# EasyEDA Pro project ui ring v1.eprj

# Schematic Schematic1
Board Name: Board1; Create Date: 2025-07-10; Page Name: P1; Project Name: ui ring v1; Schematic Name: Schematic1; Update Date: 2025-07-10; Company: EasyEDA.com; Page Size: A4; Version: V1.0
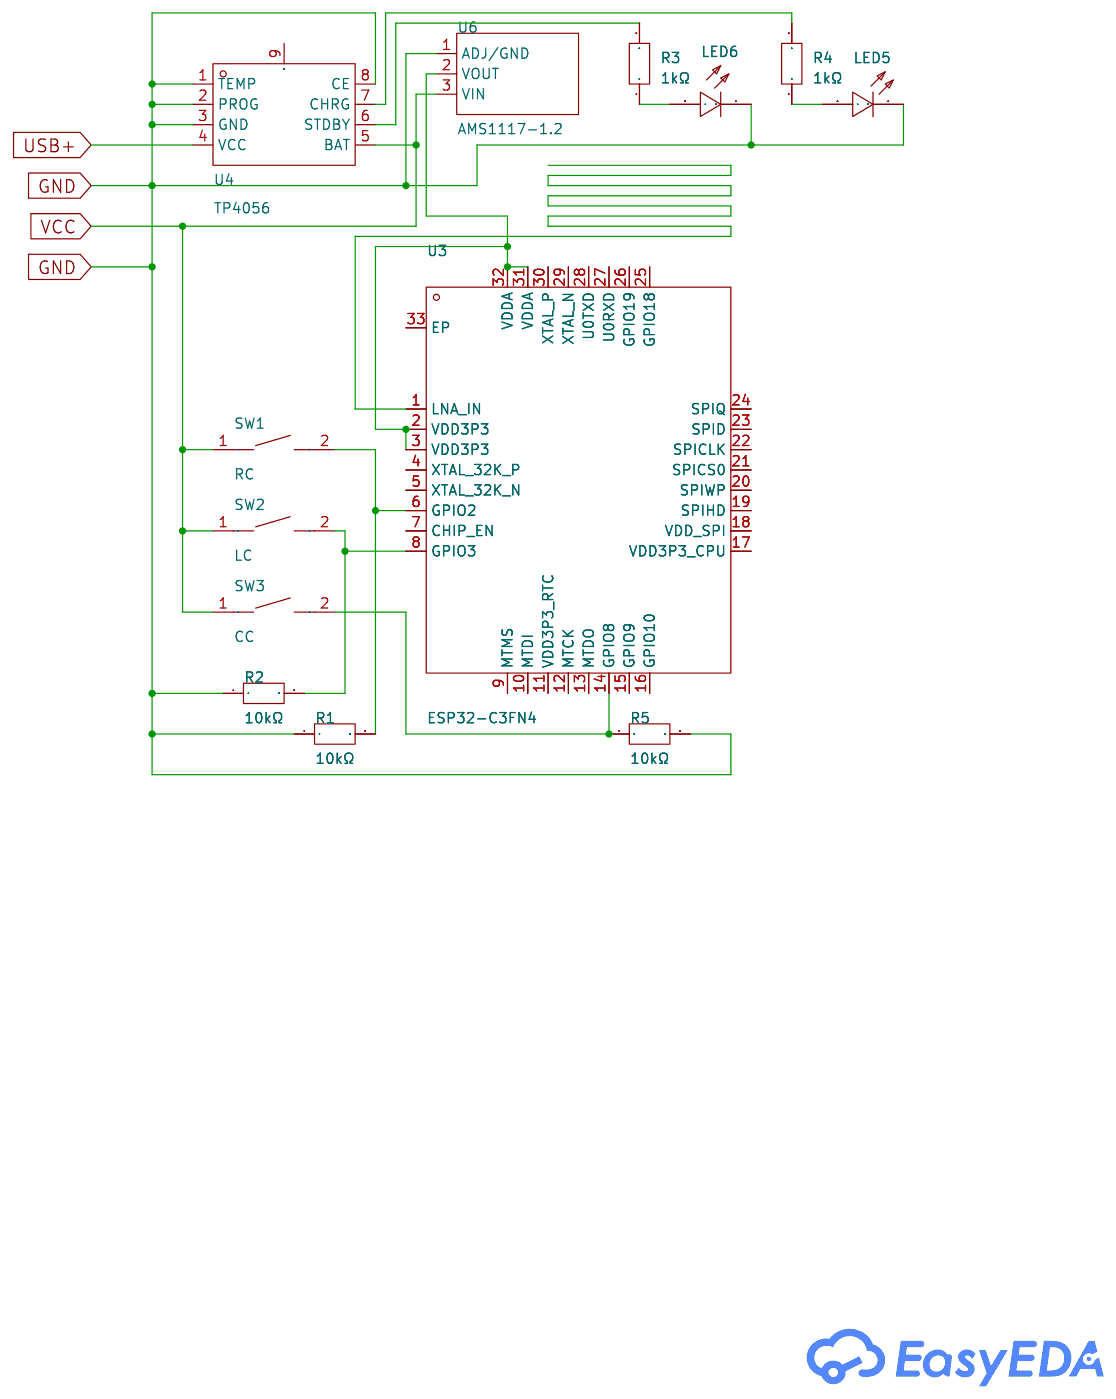
[diagram p0: schematic sheet]

## Parts
LED5  19-217/BHC-ZL1M2RY/3T  [LED0603-FD_BLUE]
LED6  19-217/R6C-AL1M2VY/3T  [LED0603-RD]
R1  10kΩ  [R0402]
R2  10kΩ  [R0402]
R3  1kΩ  [R0402]
R4  1kΩ  [R0402]
R5  10kΩ  [R0402]
SW1  RC  [SW-SMD_L3.9-W3.0-P4.45]
SW2  LC  [SW-SMD_L3.9-W3.0-P4.45]
SW3  CC  [SW-SMD_L3.9-W3.0-P4.45]
U3  ESP32-C3FN4  [QFN-32_L5.0-W5.0-P0.50-BL-EP3.7]
U4  TP4056  [ESOP-8_L4.9-W3.9-P1.27-LS6.0-BL-EP-4]
U6  AMS1117-1.2  [SOT-89-3_L4.5-W2.5-P1.50-LS4.2-BR]

## Library data of the parts
LED5 = 19-217/BHC-ZL1M2RY/3T: LCSC Part Name: 蓝灯 停产; Supplier Part: C72041; Manufacturer: EVERLIGHT(亿光); Supplier Footprint: 0603; JLCPCB Part Class: Extended Part; Datasheet: https://atta.szlcsc.com/upload/public/pdf/source/20170116/1484561237273.pdf; Supplier: LCSC; Emitted Color: Blue; Power Dissipation: 110mW; Forward Current: 5mA; Dominant Wavelength: 465nm~475nm; Peak Wavelength: 468nm; Lens Color: Colorless Transparent Lens; Viewing Angle: 120°; Operating Temperature: -40℃~+85℃
LED6 = 19-217/R6C-AL1M2VY/3T: LCSC Part Name: 红灯 停产; Supplier Part: C72044; Manufacturer: EVERLIGHT(亿光); Supplier Footprint: 0603; JLCPCB Part Class: Extended Part; Supplier: LCSC; Illumination Color: Red; Voltage - Forward(Vf): 1.95V; Power(Watts): 60mW; Forward Current: 5mA; Wavelength - Dominant: 617.5nm; Peak Wavelength: 632nm; Lens Color: Water Clear; Viewing Angle: 120°; Operating Temperature: -40℃~+85℃
R1-R5 = AC0402FR-1310KL: LCSC Part Name: 厚膜电阻 10kΩ ±1% 63mW; Supplier Part: C5455563; Manufacturer: YAGEO(国巨); Supplier Footprint: 0402; JLCPCB Part Class: Extended Part; Datasheet: https://atta.szlcsc.com/upload/public/pdf/source/20241120/4D446B3946E6DC27047BD586A1D384B4.pdf; Supplier: LCSC; Type: Thick Film Resistor; Tolerance: ±1%; Power(Watts): 63mW; Temperature Coefficient: ±100ppm/℃; Operating Temperature: -55℃~+155℃
SW1-SW3 = TS-1088-AR02016: LCSC Part Name: 4*3*2mm 立贴 轻触开关; Supplier Part: C720477; Manufacturer: XUNPU(讯普); Supplier Footprint: SMD; JLCPCB Part Class: Basic Part; Datasheet: https://atta.szlcsc.com/upload/public/pdf/source/20200810/C720475_60D09DD6C54279ADDB2DC25100F1CC11.pdf; Supplier: LCSC; Circuit: SPST; Actuator Style: Round Button; Operating Force: 160gf; Mounting Style: Brick nogging; Switch Length: 4mm; Switch Width: 3mm; Switch Height: 2mm; Strike Gundam: 不带; Contact Current: 50mA; Voltage Rating (DC): 12V; Insulation Resistance: 100MΩ; Actuator/Cap Color: Black; Pin Style: SMDSplicing; Mechanical Life: 10万次; Operating Temperature: -30℃~+80℃
U3 = ESP32-C3FN4: LCSC Part Name: 搭载 RISC-V 32 位单核处理器的极低功耗 SoC; Supplier Part: C2848860; Manufacturer: ESPRESSIF(乐鑫); Supplier Footprint: QFN-32-EP(5x5); JLCPCB Part Class: Extended Part; Datasheet: https://atta.szlcsc.com/upload/public/pdf/source/20240822/B2742F38BA1EE0E2910459276C4BCB53.pdf; Supplier: LCSC
U4 = TP4056_C20199357: Supplier Part: C20199357; Manufacturer: YONGYUTAI(永裕泰); Supplier Footprint: ESOP-8; JLCPCB Part Class: Extended Part; Datasheet: https://atta.szlcsc.com/upload/public/pdf/source/20231229/07E8AA7136184765E9792E4EED78D64E.pdf; Supplier: LCSC; Supply Voltage: 4.35V~6.5V; Maximum Charge Current: 1A; Type of Battery: Lithium-ion/Polymer; Number of Cells: 1; Operating Temperature: -40℃~+85℃
U6 = AMS1117-1.2_C963407: Supplier Part: C963407; Manufacturer: JSMSEMI(杰盛微); Supplier Footprint: SOT-89-3; JLCPCB Part Class: Extended Part; Datasheet: https://atta.szlcsc.com/upload/public/pdf/source/20240105/143A9572A7E269EE9769F526304F9FCC.pdf; Supplier: LCSC; Output Type: Fixed; Voltage - Supply: 12V; Output Voltage: 1.2V; Output Current: 1A; Power Supply Rejection Ratio (PSRR): 75dB@(120Hz); Features: Overcurrent Protection; Operating Temperature: -40℃~+125℃@(Tj); Output Configuration: Positive electrode; Number of Outputs: 1

## Nets
GND: LED5.1(C) LED6.1(C) R1.1 R2.1 R5.2 U4.1(TEMP) U4.2(PROG) U4.3(GND) U4.8(CE) U6.1(ADJ/GND)
VCC: SW1.1 SW2.1 SW3.1 U4.5(BAT) U6.3(VIN)
USB+: U4.4(VCC)
$1N2456: U3.2(VDD3P3) U3.3(VDD3P3) U3.31(VDDA) U3.32(VDDA) U6.2(VOUT)
$1N2832: LED5.2(A) R4.1
$1N2834: LED6.2(A) R3.1
$1N2838: R3.2 U4.6(STDBY)
$1N2844: R4.2 U4.7(CHRG)
$1N3009: R5.1 SW3.2 U3.14(GPIO8)
Net-(R1-2): R1.2 SW1.2 U3.6(GPIO2)
Net-(R2-2): R2.2 SW2.2 U3.8(GPIO3)

Not connected (* = marked no-connect by the designer): U3 1(LNA_IN) 4(XTAL_32K_P) 5(XTAL_32K_N) 7(CHIP_EN) 9(MTMS) 10(MTDI) 11(VDD3P3_RTC) 12(MTCK) 13(MTDO) 15(GPIO9) 16(GPIO10) 17(VDD3P3_CPU) 18(VDD_SPI) 19(SPIHD) 20(SPIWP) 21(SPICS0) 22(SPICLK) 23(SPID) 24(SPIQ) 25(GPIO18) 26(GPIO19) 27(U0RXD) 28(U0TXD) 29(XTAL_N) 30(XTAL_P) 33(EP); U4 9(PAD)

# Board PCB1
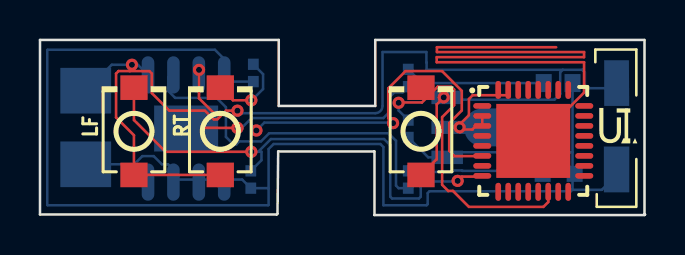
[diagram p1: board, top side]
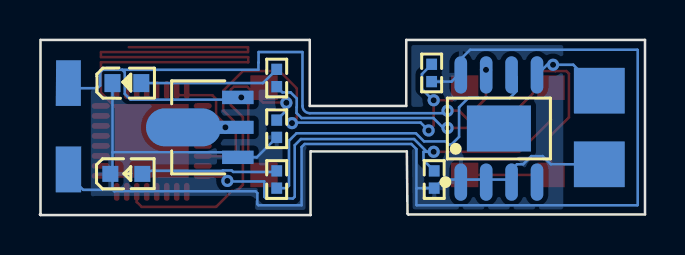
[diagram p2: board, bottom side, seen from below]

Outline 30.25 x 8.76 mm; copper layers: Top Layer, Bottom Layer. Coordinates in mm from the lower left corner of the outline.
Outline path: 0,8.76 11.94,8.76 11.94,5.46 16.76,5.46 16.76,8.76 30.23,8.76 30.23,0.05 30.25,0.03 30.22,0 16.72,0 16.72,3.18 11.91,3.18 11.88,0.07 11.84,0.03 0,0.03 0,8.76
Stack: Top Layer 0.035mm / Dielectric1 1.51mm FR4 er 4.5 / Bottom Layer 0.035mm

## Design rules (mm)
template: JLCPCB Capability(Two Layers Board)
spacing copperThickness1oz (default): track to track 0.102, other pairs 0.152 to 0.3
spacing copperThickness2oz: track to track 0.203, other pairs 0.152 to 0.3
track width copperThickness1oz (default): min 0.127, default 0.254, max 2.54
track width copperThickness2oz: min 0.203, default 0.254, max 2.54
differential pair differentialPair (default): width min 0.127, default 0.254, max 2.54; gap min 0.152, default 0.152
via viaSize (default): diameter min 0.5, default 0.61, max 10; hole min 0.3, default 0.305, max 6.3

## Placement (name value [footprint] x y rotation side)
LED5  19-217/BHC-ZL1M2RY/3T  [LED0603-FD_BLUE]  25.91 6.6 180 bottom
LED6  19-217/R6C-AL1M2VY/3T  [LED0603-RD]  25.93 2.06 180 bottom
LF  LC  [SW-SMD_L3.9-W3.0-P4.45]  4.7 4.19 90 top
NOREF  -  [Pad_e467]  2.29 6.22 0 top
NOREF#2  -  [Pad_e465]  28.83 6.6 0 top
NOREF#3  -  [Pad_e466]  28.83 2.28 0 top
NOREF#4  -  [Pad_e468]  2.29 2.54 0 top
R1  10kΩ  [R0402]  10.67 7.11 90 bottom
R2  10kΩ  [R0402]  10.54 1.78 90 bottom
R3  1kΩ  [R0402]  18.41 1.78 270 bottom
R4  1kΩ  [R0402]  18.41 6.86 270 bottom
R5  10kΩ  [R0402]  18.41 4.32 270 bottom
RT  RC  [SW-SMD_L3.9-W3.0-P4.45]  9.02 4.19 90 top
SW3  CC  [SW-SMD_L3.9-W3.0-P4.45]  19.05 4.19 90 top
U3  ESP32-C3FN4  [QFN-32_L5.0-W5.0-P0.50-BL-EP3.7]  24.66 3.71 270 top
U4  TP4056  [ESOP-8_L4.9-W3.9-P1.27-LS6.0-BL-EP-4]  7.31 4.33 180 bottom
U6  AMS1117-1.2  [SOT-89-3_L4.5-W2.5-P1.50-LS4.2-BR]  21.72 4.39 180 bottom

## Footprints (pads in the part's own frame, mm; a bottom-side part is the same pattern mirrored in y, then rotated)
ESOP-8_L4.9-W3.9-P1.27-LS6.0-BL-EP-4
  oval 0.63x1.865 smd: 1(-1.905,-2.683) 2(-0.635,-2.683) 3(0.635,-2.683) 4(1.905,-2.683) 5(1.905,2.683) 6(0.635,2.683) 7(-0.635,2.683) 8(-1.905,2.683)
  rect 3.2x2.3 smd: 9(0,0)
LED0603-FD_BLUE
  rect 0.8x0.9 smd: 1(-0.72,0) 2(0.72,0)
LED0603-RD
  rect 0.8x0.8 smd: 1(-0.799,0) 2(0.799,0)
Pad_e465
  custom 1.27x2.286 smd far side: 4(0,0)
Pad_e466
  custom 1.288x2.292 smd far side: 34(0,0)
Pad_e467
  custom 2.546x2.286 smd far side: 35(0,0)
Pad_e468
  custom 2.54x2.286 smd far side: 36(0,0)
QFN-32_L5.0-W5.0-P0.50-BL-EP3.7
  oval 0.28x0.9 smd: 1(-1.75,-2.55) 2(-1.25,-2.55) 3(-0.75,-2.55) 4(-0.25,-2.55) 5(0.25,-2.55) 6(0.75,-2.55) 7(1.25,-2.55) 8(1.75,-2.55) 17(1.75,2.55) 18(1.25,2.55) 19(0.75,2.55) 20(0.25,2.55) 21(-0.25,2.55) 22(-0.75,2.55) 23(-1.25,2.55) 24(-1.75,2.55)
  oval 0.9x0.28 smd: 9(2.55,-1.75) 10(2.55,-1.25) 11(2.55,-0.75) 12(2.55,-0.25) 13(2.55,0.25) 14(2.55,0.75) 15(2.55,1.25) 16(2.55,1.75) 25(-2.55,1.75) 26(-2.55,1.25) 27(-2.55,0.75) 28(-2.55,0.25) 29(-2.55,-0.25) 30(-2.55,-0.75) 31(-2.55,-1.25) 32(-2.55,-1.75)
  rect 3.7x3.7 smd: 33(0,0)
R0402
  rect 0.566x0.54 smd: 1(-0.433,0) 2(0.433,0)
SOT-89-3_L4.5-W2.5-P1.50-LS4.2-BR
  rect 1.575x0.672 smd: 1(1.356,-1.5) 3(1.356,1.5)
  custom 5.377x1.9 smd: 2(-1.356,0)
SW-SMD_L3.9-W3.0-P4.45
  rect 1.23x1.36 smd: 1(-2.185,0) 2(2.185,0)

## Nets
GND: LED5.1 LED6.1 NOREF#3.34 NOREF#4.36 R1.1 R2.1 R5.2 U4.1 U4.2 U4.3 U4.8 U6.1
VCC: LF.1 NOREF.35 NOREF#2.4 RT.1 SW3.1 U4.5 U6.3
USB+: U4.4
$1N1645: R1.2 RT.2 U3.6
$1N2291: LF.2 R2.2 U3.8
$1N2456: U3.2 U3.3 U3.31 U3.32 U6.2
$1N2832: LED5.2 R4.1
$1N2834: LED6.2 R3.1
$1N2838: R3.2 U4.6
$1N2844: R4.2 U4.7
$1N3009: R5.1 SW3.2 U3.14
$1N4045: U3.1

Pads without a net: U3 4 5 7 9 10 11 12 13 15 16 17 18 19 20 21 22 23 24 25 26 27 28 29 30 33; U4 9

## Via types
v1: diameter 0.61, hole 0.305, Top Layer to Bottom Layer, 12 vias

## Routing (per net, layer and track width the routed paths; a pad name or vN(x,y) marks a point on that pad's centre or on a via; arc(x,y) is an arc through that point)
GND: length 79.1
  Bottom Layer w0.127: 11.43,1.32 11.43,0.51 11.41,0.49 0.38,0.49 0.36,0.51 0.36,8.25 0.38,8.27 8.75,8.27 9.21,7.81 9.21,7.14 9.67,6.68 R1.1 ; 11.43,1.32 11.41,1.34 R2.1 10.11,1.78 6.67,1.78 6.67,2.27 6.4,2.54 6.09,2.54 5.68,2.95 5.12,2.95 4.71,2.54 NOREF#4.36 ; 11.43,1.32 11.43,3.3 11.68,3.56 17.02,3.56 17.17,3.4 17.17,0.49 19.33,0.49 19.38,0.55 19.38,1.1 19.47,1.19 26.54,1.19 26.61,1.26 ; R5.2 19.41,2.89 20.36,2.89 20.61,3.14 26.63,3.14 ; 26.61,1.26 26.63,1.28 26.63,3.14 ; 26.61,1.26 28.09,1.26 28.83,2 ; 26.63,3.14 LED5.1
  Bottom Layer w0.254: 28.83,2 NOREF#3.34
VCC: length 57.2
  Top Layer w0.127: 19.05,2.01 19.84,2.79 19.84,5.54 v1(20.19,5.89) ; 4.49,7.21 5.47,7.21 5.59,7.08 5.59,6.1 6.47,5.22 8.25,5.22 8.68,4.79 8.87,4.79 9.3,5.22 v1(9.87,5.22) ; 4.49,7.21 4.6,7.32 v1(4.6,7.52) ; 4.49,7.21 3.93,7.21 3.8,7.08 3.8,4.89 4.7,3.99 4.7,2.01 9.02,2.01
  Bottom Layer w0.127: U4.5 4.89,7.52 v1(4.6,7.52) 3.59,7.52 NOREF.35 ; v1(20.19,5.89) 20.3,5.77 25.72,5.77 26.01,6.06 26.01,7.14 26.14,7.27 ; v1(9.87,5.22) 10,5.1 16.76,5.1 arc(17.02,5.2) 17.13,5.46 17.13,8.16 19.32,8.16 19.32,7.64 19.33,7.64 19.33,7.27 26.14,7.27 ; 26.14,7.27 27.12,7.27 27.24,7.14 27.24,6.48 27.37,6.35 28.58,6.35 28.84,6.6
(no net): length 33.9
  Top Layer w0.127: 25.81,8.4 19.85,8.4 19.85,8.17 19.86,8.16 27.2,8.16 27.2,7.9 19.84,7.9 19.84,7.65 27.2,7.65 27.2,6.12 24.79,3.71 U3.33
$1N1645: length 24.1
  Top Layer w0.127: RT.2 9.65,5.74 v1(10.57,5.74) 10.57,4.49 v1(10.82,4.23) ; v1(17.65,4.6) 17.41,4.84 17.41,6.34 18.28,7.21 20.1,7.21 21.09,6.22 21.09,5.23 20.46,4.6 20.46,3.21 20.73,2.95 22.25,2.95
  Bottom Layer w0.127: v1(17.65,4.6) 17.63,4.63 11.21,4.63 v1(10.82,4.23) ; R1.2 10.67,7.54 11.15,7.05 11.15,6.31 10.67,5.82 10.64,5.82 v1(10.57,5.74)
$1N2291: length 25.2
  Top Layer w0.127: v1(10.57,3.17) 6.29,3.17 4.7,4.75 LF.2 ; 22.33,1.92 21.1,1.92 v1(20.88,1.71)
  Bottom Layer w0.127: 10.91,3.17 v1(10.57,3.17) ; 10.91,3.17 11.08,3.17 11.08,2.74 R2.2 ; 10.91,3.17 11.55,3.8 17.21,3.8 17.51,3.49 17.51,0.92 17.6,0.83 18.95,0.83 19.04,0.92 19.04,1.68 20.85,1.68 v1(20.88,1.71)
$1N2456: length 5.4
  Top Layer w0.127: 22.11,4.96 22.11,4.46 21.8,4.46 21.62,4.28 21.16,4.28 21.06,4.39 v1(20.98,4.39) 20.98,4.53 21.45,5 21.45,5.81 21.64,6 23.4,6 23.41,6.01
$1N2832: length 7.1
  Bottom Layer w0.127: R4.1 19.1,6.6 LED5.2
$1N2834: length 7
  Bottom Layer w0.127: R3.1 18.54,2.21 18.59,2.16 20.6,2.16 20.67,2.23 21.1,2.23 21.12,2.21 25.06,2.21 25.24,2.03
$1N2838: length 17.6
  Bottom Layer w0.127: R3.2 17.93,1.34 17.8,1.47 17.8,3.71 17.43,4.09 11.46,4.09 11.05,3.69 9.97,3.69 9.81,3.53 9.68,3.53 9.3,3.91 9.3,5.39 8.83,5.87 6.76,5.87 6.42,6.2 6.42,6.89 6.54,7.01 U4.6
$1N2844: length 14.3
  Top Layer w0.127: 8.77,5.02 7.95,5.84 v1(7.95,7.27) ; v1(9.87,4.36) 8.28,4.36
  Bottom Layer w0.127: R4.2 18.13,6.14 17.72,6.14 17.41,5.83 17.41,5.4 17.43,5.39 17.43,5.11 17.17,4.85 10.58,4.85 10.08,4.36 v1(9.87,4.36) ; U4.7 7.94,7.26 v1(7.95,7.27)
$1N3009: length 15.6
  Top Layer w0.127: U3.14 25.41,0.65 25.17,0.41 21.45,0.41 20.65,1.21 20.41,1.21 20.11,1.51 20.11,4.9 20.71,5.5 20.71,6.28 20.56,6.43 19.89,6.43 19.1,5.63 17.95,5.63 v1(17.93,5.62)
  Bottom Layer w0.127: v1(17.93,5.62) 17.93,5.23 R5.1

## Copper pours and planes (outline as drawn; the poured copper is in the pictures)
GND on Bottom Layer: 4.09,9.68 27.71,9.68 27.71,-1.88 4.09,-1.88
GND on Bottom Layer: 28.19,7.75 29.46,7.75 29.46,5.46 28.19,5.46
GND on Bottom Layer: 28.19,3.43 29.46,3.43 29.46,1.14 28.19,1.14
(no net) on Bottom Layer: 1.02,3.68 3.56,3.68 3.56,1.4 1.02,1.4
(no net) on Bottom Layer: 1.02,7.37 3.56,7.37 3.56,5.08 1.02,5.08
